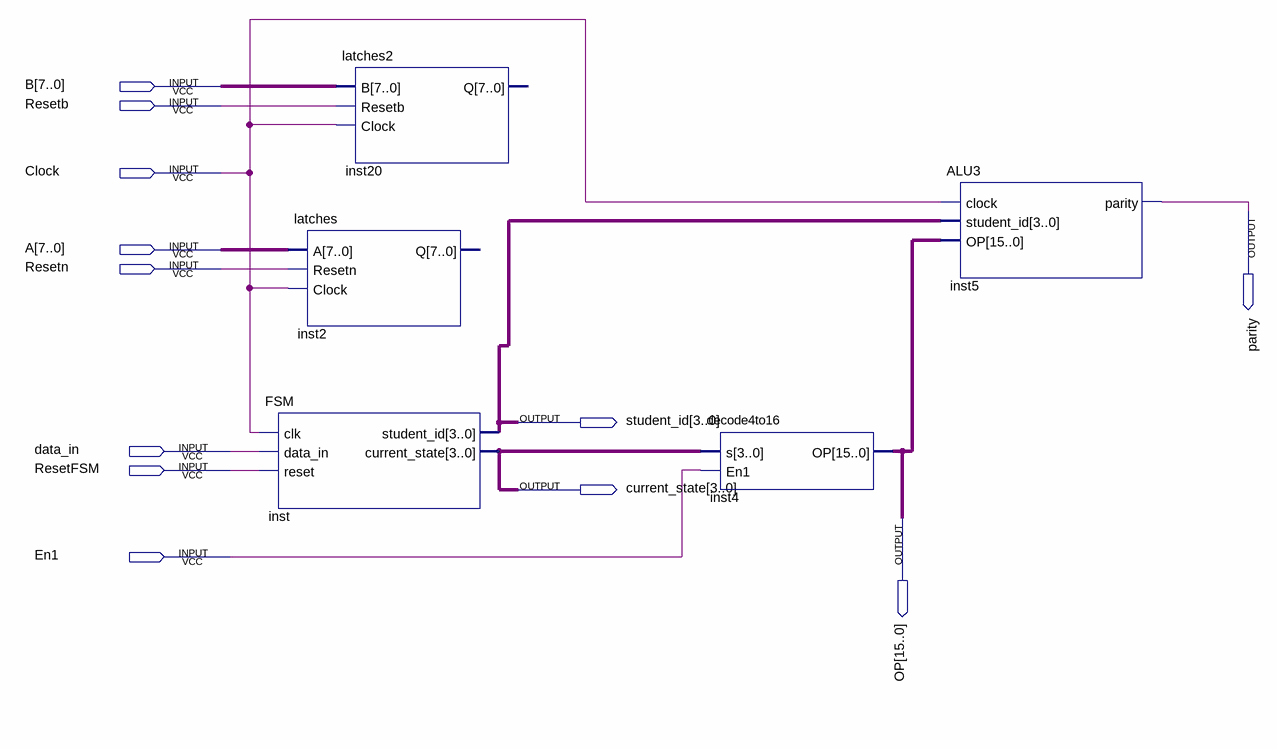
[diagram p0: schematic sheet]
// Quartus schematic P3.bdf as structural Verilog: 5 symbols, 12 pins
module P3 (
  input  [7:0] B,
  input  Resetb,
  input  Clock,
  input  [7:0] A,
  input  Resetn,
  input  data_in,
  input  ResetFSM,
  input  En1,
  output parity,
  output [3:0] student_id,
  output [3:0] current_state,
  output [15:0] OP
);

  FSM inst (.clk(Clock), .data_in(data_in), .reset(ResetFSM), .student_id(student_id), .current_state(current_state));
  latches2 inst20 (.B(B), .Resetb(Resetb), .Clock(Clock));  // open: Q
  latches inst2 (.A(A), .Resetn(Resetn), .Clock(Clock));  // open: Q
  decode4to16 inst4 (.s(current_state), .En1(En1), .OP(OP));
  ALU3 inst5 (.clock(Clock), .student_id(student_id), .OP(OP), .parity(parity));
endmodule
